# Altium schematic sheet Task2.SchDoc
size A4
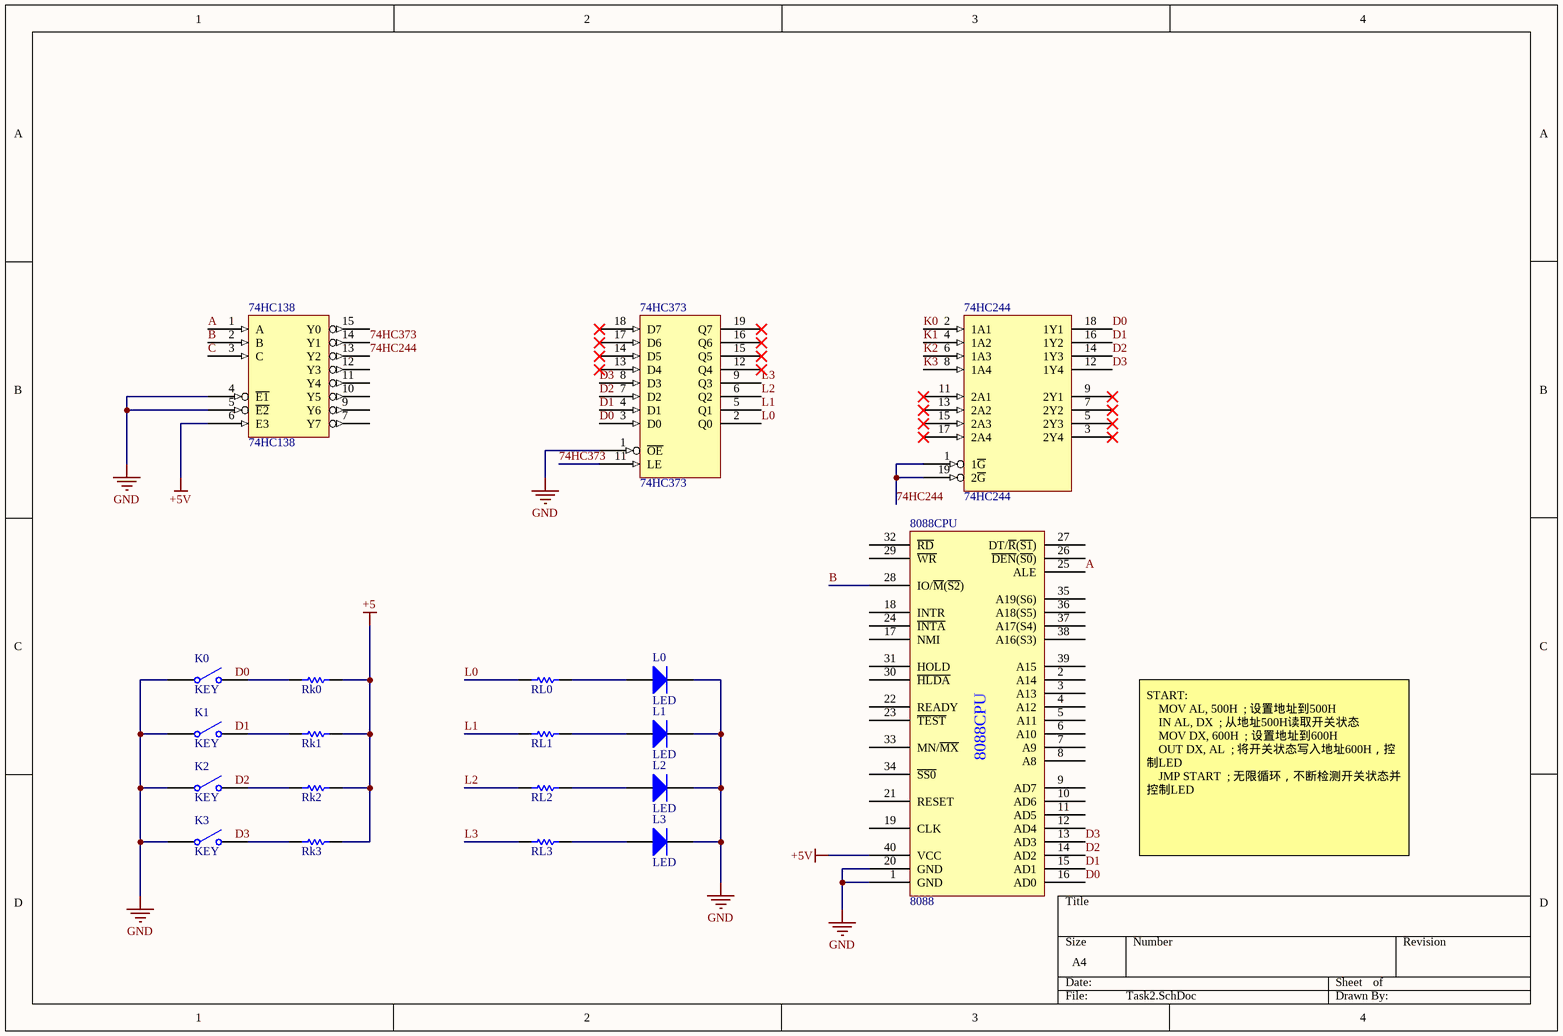
[diagram p0: Task2.SchDoc]

## Parts
74HC138  74HC138
74HC244  74HC244
74HC373  74HC373
8088CPU  8088
K0  KEY
K1  KEY
K2  KEY
K3  KEY
L0  LED
L1  LED
L2  LED
L3  LED
Rk0  Res  (value not drawn)
Rk1  Res  (value not drawn)
Rk2  Res  (value not drawn)
Rk3  Res  (value not drawn)
RL0  Res  (value not drawn)
RL1  Res  (value not drawn)
RL2  Res  (value not drawn)
RL3  Res  (value not drawn)

## Nets
+5: Rk0.2 Rk1.2 Rk2.2 Rk3.2
+5V: 74HC138.6(E3) 8088CPU.40(VCC)
GND: 74HC138.4(~{E1}) 74HC138.5(~{E2}) 74HC373.1(~{OE}) 8088CPU.1(GND) 8088CPU.20(GND) K0.1(COMMON) K1.1(COMMON) K2.1(COMMON) K3.1(COMMON) L0.2(K) L1.2(K) L2.2(K) L3.2(K)
74HC244: 74HC138.13(Y2) 74HC244.1(1~{G}) 74HC244.19(2~{G})
74HC373: 74HC138.14(Y1) 74HC373.11(LE)
A: 74HC138.1(A) 8088CPU.25(ALE)
B: 74HC138.2(B) 8088CPU.28(IO/~{M}(~{S2}))
C: 74HC138.3(C)
D0: 74HC244.18(1Y1) 74HC373.3(D0) 8088CPU.16(AD0)
D1: 74HC244.16(1Y2) 74HC373.4(D1) 8088CPU.15(AD1)
D2: 74HC244.14(1Y3) 74HC373.7(D2) 8088CPU.14(AD2)
D3: 74HC244.12(1Y4) 74HC373.8(D3) 8088CPU.13(AD3)
K0: 74HC244.2(1A1)
K1: 74HC244.4(1A2)
K2: 74HC244.6(1A3)
K3: 74HC244.8(1A4)
L0: 74HC373.2(Q0) RL0.1
L1: 74HC373.5(Q1) RL1.1
L2: 74HC373.6(Q2) RL2.1
L3: 74HC373.9(Q3) RL3.1
NetK0_2: K0.2(NO) Rk0.1
NetK1_2: K1.2(NO) Rk1.1
NetK2_2: K2.2(NO) Rk2.1
NetK3_2: K3.2(NO) Rk3.1
NetL0_1: L0.1(A) RL0.2
NetL1_1: L1.1(A) RL1.2
NetL2_1: L2.1(A) RL2.2
NetL3_1: L3.1(A) RL3.2

Not connected (* = marked no-connect by the designer): 74HC138 7(Y7) 9(Y6) 10(Y5) 11(Y4) 12(Y3) 15(Y0); 74HC244 3(2Y4)* 5(2Y3)* 7(2Y2)* 9(2Y1)* 11(2A1)* 13(2A2)* 15(2A3)* 17(2A4)*; 74HC373 12(Q4)* 13(D4)* 14(D5)* 15(Q5)* 16(Q6)* 17(D6)* 18(D7)* 19(Q7)*; 8088CPU 2(A14) 3(A13) 4(A12) 5(A11) 6(A10) 7(A9) 8(A8) 9(AD7) 10(AD6) 11(AD5) 12(AD4) 17(NMI) 18(INTR) 19(CLK) 21(RESET) 22(READY) 23(~{TEST}) 24(~{INTA}) 26(~{DEN}(~{S0})) 27(DT/~{R}(~{S1})) 29(~{WR}) 30(~{HLDA}) 31(HOLD) 32(~{RD}) 33(MN/~{MX}) 34(~{SS0}) 35(A19(S6)) 36(A18(S5)) 37(A17(S4)) 38(A16(S3)) 39(A15)

## Notes on the sheet
- START:
  MOV AL, 500H  ; 设置地址到500H
  IN AL, DX  ; 从地址500H读取开关状态
  MOV DX, 600H  ; 设置地址到600H
  OUT DX, AL  ; 将开关状态写入地址600H，控制LED
  JMP START  ; 无限循环，不断检测开关状态并控制LED
- Labels drawn without touching a wire or pin: D0, D1, D2, D3